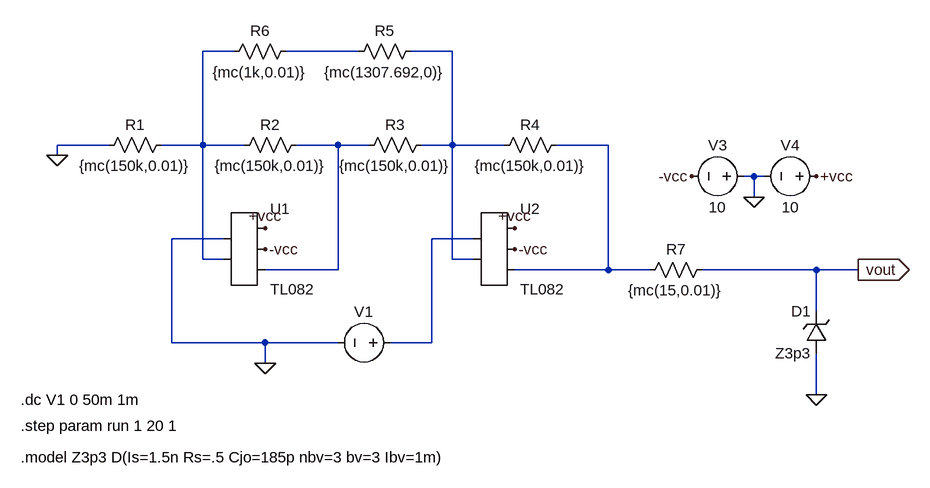
[diagram p0: schematic pressureSensor_montecarlo.asc]
pressureSensor_montecarlo.asc, the LTspice schematic file:
Version 4
SHEET 1 1132 680
WIRE 64 -112 16 -112
WIRE 256 -112 144 -112
WIRE 400 -112 336 -112
WIRE -128 32 -208 32
WIRE 16 32 16 -112
WIRE 16 32 -48 32
WIRE 80 32 16 32
WIRE 224 32 160 32
WIRE 272 32 224 32
WIRE 400 32 400 -112
WIRE 400 32 352 32
WIRE 480 32 400 32
WIRE 640 32 560 32
WIRE -208 48 -208 32
WIRE 864 80 848 80
WIRE 880 80 864 80
WIRE 864 112 864 80
WIRE 48 176 -32 176
WIRE 432 176 368 176
WIRE 16 208 16 32
WIRE 48 208 16 208
WIRE 400 208 400 32
WIRE 432 208 400 208
WIRE 224 224 224 32
WIRE 224 224 112 224
WIRE 640 224 640 32
WIRE 640 224 496 224
WIRE 704 224 640 224
WIRE 960 224 784 224
WIRE 1024 224 960 224
WIRE 960 288 960 224
WIRE -32 336 -32 176
WIRE 112 336 -32 336
WIRE 224 336 112 336
WIRE 368 336 368 176
WIRE 368 336 304 336
WIRE 112 368 112 336
WIRE 960 416 960 352
FLAG 112 160 +vcc
FLAG 496 160 +vcc
FLAG 112 192 -vcc
FLAG 496 192 -vcc
FLAG -208 48 0
FLAG 1024 224 vout
IOPIN 1024 224 Out
FLAG 960 80 +vcc
FLAG 768 80 -vcc
FLAG 864 112 0
FLAG 112 368 0
FLAG 960 416 0
SYMBOL AutoGenerated\\TL082 80 192 R0
SYMATTR InstName U1
SYMBOL AutoGenerated\\TL082 464 192 R0
SYMATTR InstName U2
SYMBOL res -32 16 R90
WINDOW 0 0 56 VBottom 2
WINDOW 3 32 56 VTop 2
SYMATTR InstName R1
SYMATTR Value {mc(150k,0.01)}
SYMBOL res 176 16 R90
WINDOW 0 0 56 VBottom 2
WINDOW 3 32 56 VTop 2
SYMATTR InstName R2
SYMATTR Value {mc(150k,0.01)}
SYMBOL res 368 16 R90
WINDOW 0 0 56 VBottom 2
WINDOW 3 32 56 VTop 2
SYMATTR InstName R3
SYMATTR Value {mc(150k,0.01)}
SYMBOL res 576 16 R90
WINDOW 0 0 56 VBottom 2
WINDOW 3 32 56 VTop 2
SYMATTR InstName R4
SYMATTR Value {mc(150k,0.01)}
SYMBOL voltage 864 80 R90
WINDOW 0 -32 56 VBottom 2
WINDOW 3 32 56 VTop 2
WINDOW 123 0 0 Left 0
WINDOW 39 0 0 Left 0
SYMATTR InstName V3
SYMATTR Value 10
SYMBOL voltage 976 80 R90
WINDOW 0 -32 56 VBottom 2
WINDOW 3 32 56 VTop 2
WINDOW 123 0 0 Left 0
WINDOW 39 0 0 Left 0
SYMATTR InstName V4
SYMATTR Value 10
SYMBOL res 352 -128 R90
WINDOW 0 0 56 VBottom 2
WINDOW 3 32 56 VTop 2
SYMATTR InstName R5
SYMATTR Value {mc(1307.692,0)}
SYMBOL res 160 -128 R90
WINDOW 0 0 56 VBottom 2
WINDOW 3 32 56 VTop 2
SYMATTR InstName R6
SYMATTR Value {mc(1k,0.01)}
SYMBOL voltage 320 336 R90
WINDOW 0 -32 56 VBottom 2
WINDOW 3 32 56 VTop 2
WINDOW 123 0 0 Left 0
WINDOW 39 0 0 Left 0
SYMATTR InstName V1
SYMATTR Value ""
SYMBOL res 800 208 R90
WINDOW 0 0 56 VBottom 2
WINDOW 3 32 56 VTop 2
SYMATTR InstName R7
SYMATTR Value {mc(15,0.01)}
SYMBOL zener 976 352 R180
WINDOW 0 24 64 Left 2
WINDOW 3 24 0 Left 2
SYMATTR InstName D1
SYMATTR Value Z3p3
TEXT -264 424 Left 2 !.dc V1 0 50m 1m
TEXT -264 464 Left 2 !.step param run 1 20 1
TEXT -264 512 Left 2 !.model Z3p3 D(Is=1.5n Rs=.5 Cjo=185p nbv=3 bv=3 Ibv=1m)

The netlist it stands for:
* pressureSensor_montecarlo.asc
* U1: TL082 (symbol AutoGenerated\TL082 not available, pins judged from their places): pin1=0 pin2=N001 pin3=+vcc pin4=-vcc pin5=N004
* U2: TL082 (symbol AutoGenerated\TL082 not available, pins judged from their places): pin1=N006 pin2=N003 pin3=+vcc pin4=-vcc pin5=N005
R1 N001 0 {mc(150k,0.01)}
R2 N004 N001 {mc(150k,0.01)}
R3 N003 N004 {mc(150k,0.01)}
R4 N005 N003 {mc(150k,0.01)}
V3 0 -vcc 10
V4 +vcc 0 10
R5 N003 N002 {mc(1307.692,0)}
R6 N002 N001 {mc(1k,0.01)}
V1 N006 0
R7 vout N005 {mc(15,0.01)}
D1 0 vout Z3p3
.model D D
.lib standard.dio
.dc V1 0 50m 1m
.step param run 1 20 1
.model Z3p3 D(Is=1.5n Rs=.5 Cjo=185p nbv=3 bv=3 Ibv=1m)
.backanno
.end